# Altium schematic sheet TYPE-C 6P1_TYPE-C 6P.schdoc
size 127 x 99 mm
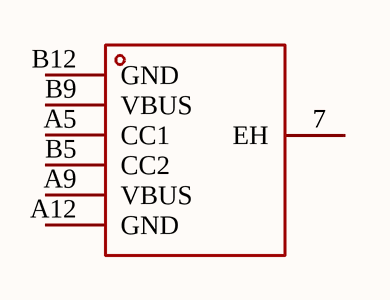
[diagram p0: TYPE-C 6P1_TYPE-C 6P.schdoc]

## Parts
USB?  TYPE-C 6P  [TYPE-C-SMD_TYPE-C-6P]  (value not drawn)

## Nets

Not connected (* = marked no-connect by the designer): USB? 7(EH) A5(CC1) A9(VBUS) A12(GND) B5(CC2) B9(VBUS) B12(GND)

## Library data of the parts
USB? = TYPE-C 6P: Manufacturer: SHOU HAN(首韩); Add into BOM: yes; Gender: 母; Number of Ports: 1; Current Rating - Power (Max): 5A; Rated Voltage (Max): 20V; Connect-Disconnect Life: 3千次; Core Colour: 黑色; Symbol: TYPE-C 6P; Device: TYPE-C 6P; LCSC Part Name: Type-C 母 卧贴; Supplier Part: C456012; Manufacturer Part: TYPE-C 6P; Supplier Footprint: SMD; JLCPCB Part Class: Extended Part; Datasheet: https://atta.szlcsc.com/upload/public/pdf/source/20201203/C456012_B13F72044DF846EDBE9BDD0D1D3CD166.pdf; Supplier: LCSC; Convert to PCB: yes; Connector Type: Type-C; Standard: USB 3.1; Mounting Style: 卧贴; Number of Contacts: 6P; Operating Temperature Range: -40℃~+85℃